# Altium project INPUT.PrjPcb
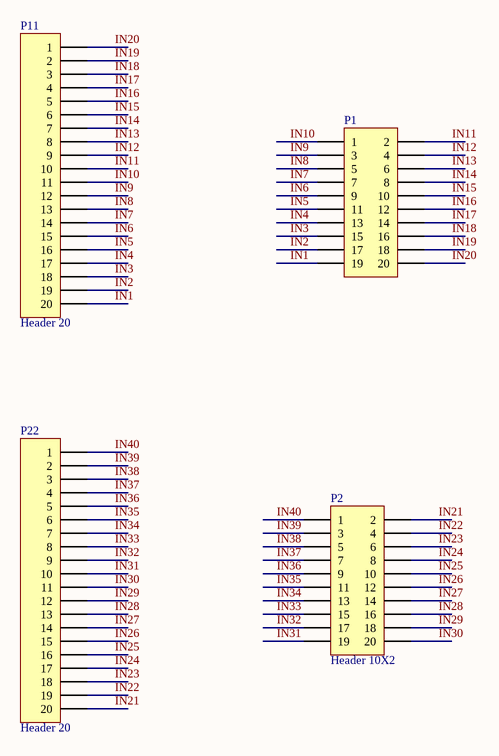
[diagram p0: input.SchDoc]
1 sheet, 4 parts. Net scope: global (net labels, ports and power ports of the same name join across sheets).
Board file: input.PcbDoc

## Sheet input.SchDoc
size A

### Parts
P1  Header 10X2  [HDR2X10]  (value not drawn)
P2  Header 10X2  [HDR2X10]
P11  Header 20  [HDR1X20]
P22  Header 20  [HDR1X20]

### Nets
IN1: P1.19 P11.20
IN2: P1.17 P11.19
IN3: P1.15 P11.18
IN4: P1.13 P11.17
IN5: P1.11 P11.16
IN6: P1.9 P11.15
IN7: P1.7 P11.14
IN8: P1.5 P11.13
IN9: P1.3 P11.12
IN10: P1.1 P11.11
IN11: P1.2 P11.10
IN12: P1.4 P11.9
IN13: P1.6 P11.8
IN14: P1.8 P11.7
IN15: P1.10 P11.6
IN16: P1.12 P11.5
IN17: P1.14 P11.4
IN18: P1.16 P11.3
IN19: P1.18 P11.2
IN20: P1.20 P11.1
IN21: P2.2 P22.20
IN22: P2.4 P22.19
IN23: P2.6 P22.18
IN24: P2.8 P22.17
IN25: P2.10 P22.16
IN26: P2.12 P22.15
IN27: P2.14 P22.14
IN28: P2.16 P22.13
IN29: P2.18 P22.12
IN30: P2.20 P22.11
IN31: P2.19 P22.10
IN32: P2.17 P22.9
IN33: P2.15 P22.8
IN34: P2.13 P22.7
IN35: P2.11 P22.6
IN36: P2.9 P22.5
IN37: P2.7 P22.4
IN38: P2.5 P22.3
IN39: P2.3 P22.2
IN40: P2.1 P22.1

### Library data of the parts
P1 P2 = Header 10X2: Header, 10-Pin, Dual row; LatestRevisionDate: 17-Jul-2002; LatestRevisionNote: Re-released for DXP Platform.; Publisher: Altium Limited
P11 P22 = Header 20: Header, 20-Pin; LatestRevisionDate: 17-Jul-2002; LatestRevisionNote: Re-released for DXP Platform.; Publisher: Altium Limited